# EAGLE schematic Street_Fighter_v1.2 (EAGLE 7.5.0)
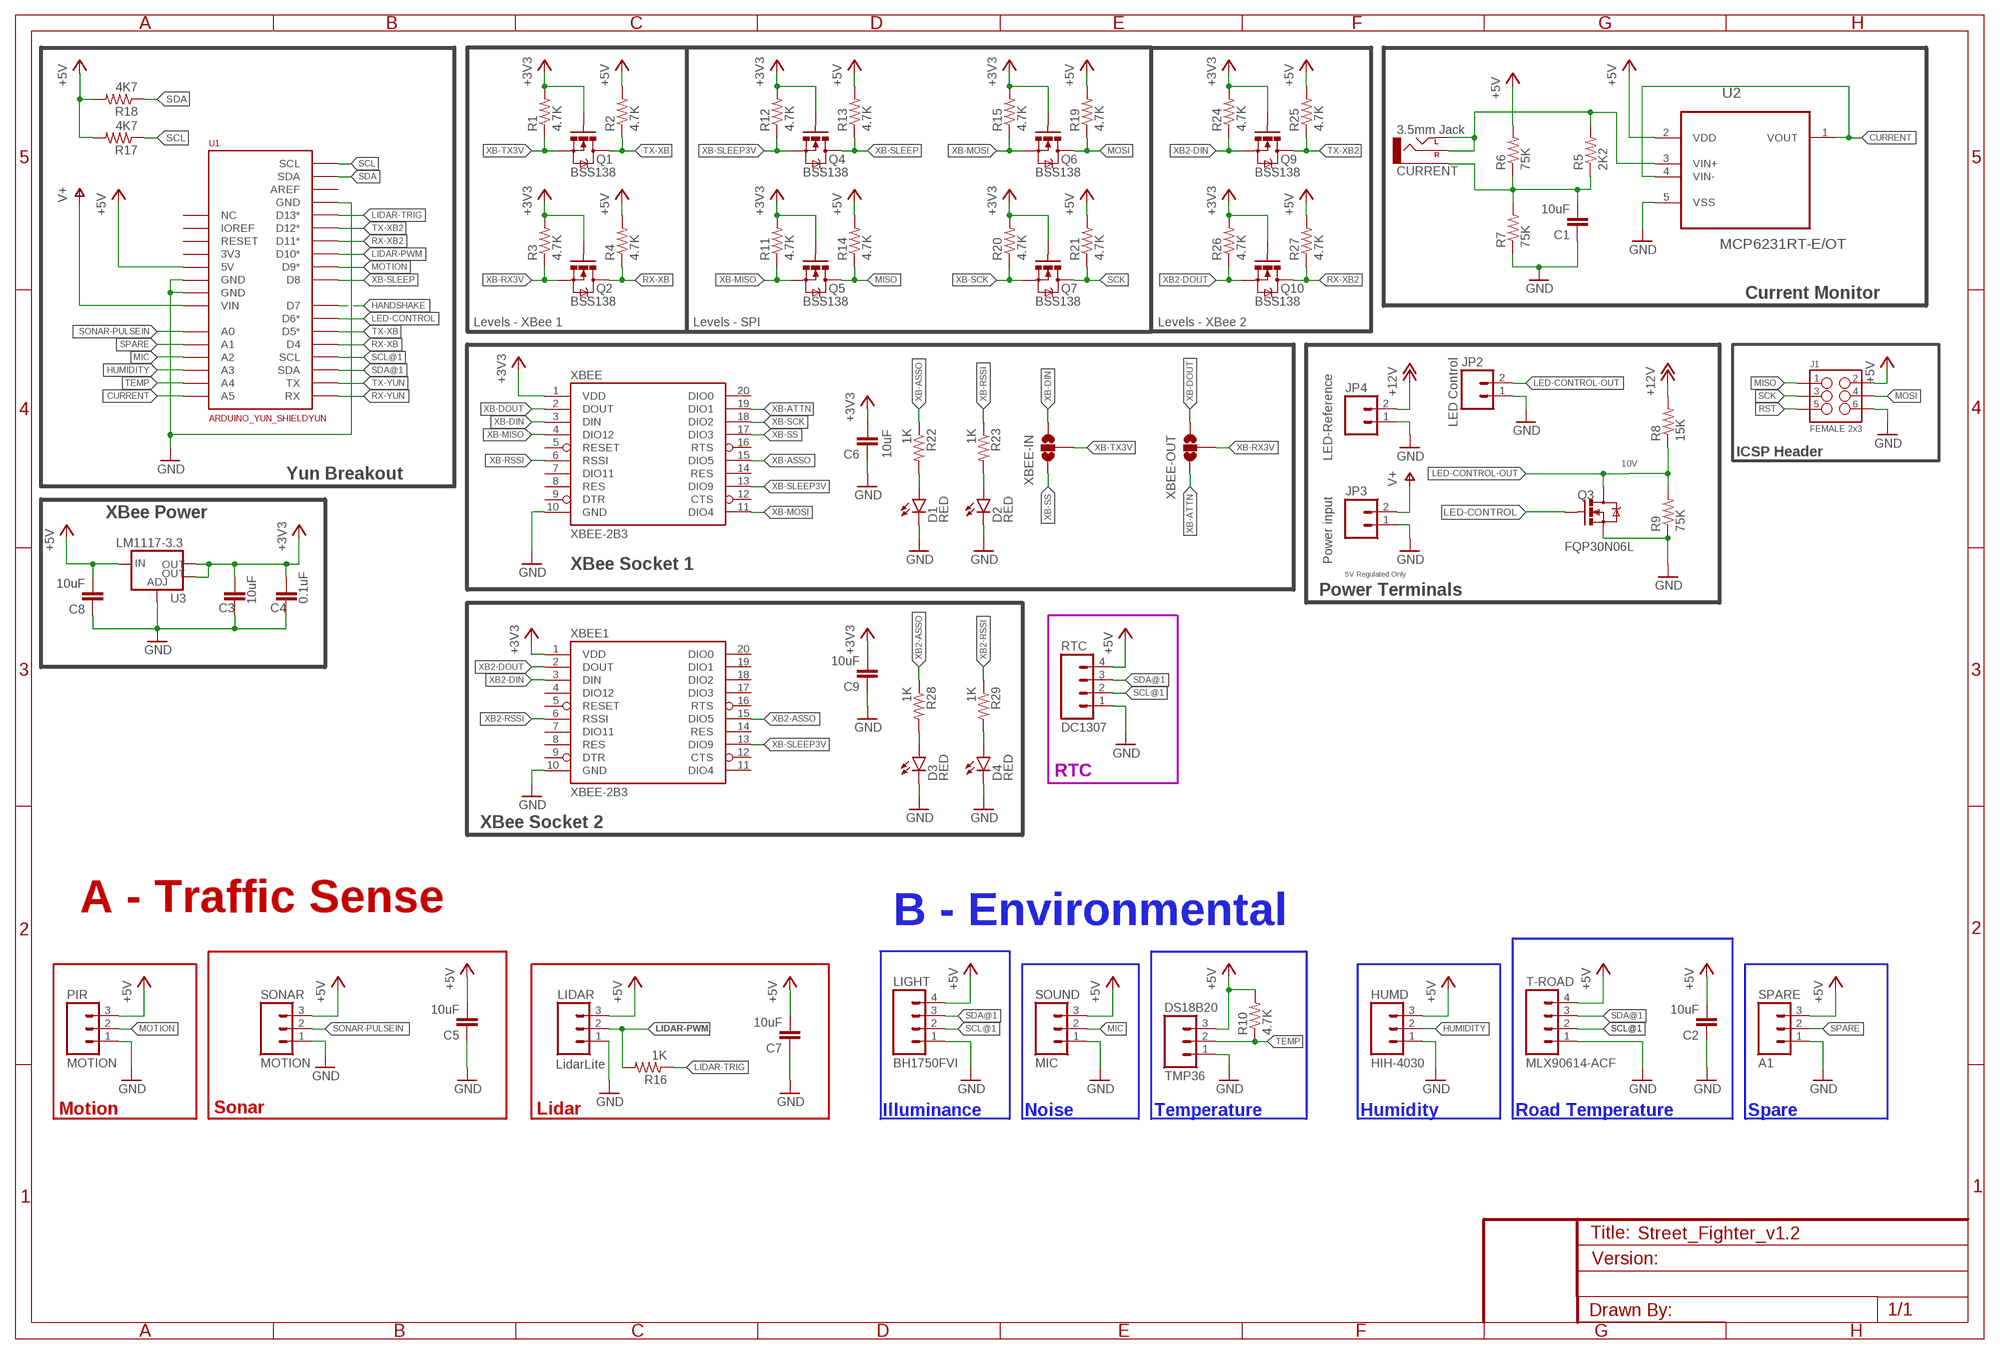
[diagram p0: schematic, sheet 1]

## Parts
C1  10uF  10UF-6.3V-20%(1206)  [1206]
C2  10uF  10UF-6.3V-20%(1206)  [1206]
C3  10uF  10UF-6.3V-20%(1206)  [1206]
C4  0.1uF  10UF-6.3V-20%(1206)  [1206]
C5  10uF  10UF-6.3V-20%(1206)  [1206]
C6  10uF  10UF-6.3V-20%(1206)  [1206]
C7  10uF  10UF-6.3V-20%(1206)  [1206]
C8  10uF  10UF-6.3V-20%(1206)  [1206]
C9  10uF  10UF-6.3V-20%(1206)  [1206]
CURRENT  3.5mm Jack  AUDIO-JACKPTH  [AUDIO-JACK]
D1  RED  LED-RED1206  [LED-1206]
D2  RED  LED-RED1206  [LED-1206]
D3  RED  LED-RED1206  [LED-1206]
D4  RED  LED-RED1206  [LED-1206]
DS18B20  TMP36  M03PTH  [1X03]
HUMD  HIH-4030  M03PTH  [1X03]
J1  FEMALE 2x3  M03X2FEMALE  [2X3]
JP2  LED Control  M02PTH3  [1X02_LONGPADS]
JP3  Power input  M02PTH3  [1X02_LONGPADS]
JP4  LED-Reference  M02PTH3  [1X02_LONGPADS]
LIDAR  LidarLite  M03PTH  [1X03]
LIGHT  BH1750FVI  M04PTH  [1X04]
PIR  MOTION  M03PTH  [1X03]
Q1  BSS138  MOSFET-NCHANNELBSS123LT1G  [SOT23]
Q2  BSS138  MOSFET-NCHANNELBSS123LT1G  [SOT23]
Q3  FQP30N06L  MOSFET-NCHANNELFQP30N06L  [TO220V]
Q4  BSS138  MOSFET-NCHANNELBSS123LT1G  [SOT23]
Q5  BSS138  MOSFET-NCHANNELBSS123LT1G  [SOT23]
Q6  BSS138  MOSFET-NCHANNELBSS123LT1G  [SOT23]
Q7  BSS138  MOSFET-NCHANNELBSS123LT1G  [SOT23]
Q9  BSS138  MOSFET-NCHANNELBSS123LT1G  [SOT23]
Q10  BSS138  MOSFET-NCHANNELBSS123LT1G  [SOT23]
R1  4.7K  RESISTOR1206  [1206]
R2  4.7K  RESISTOR1206  [1206]
R3  4.7K  RESISTOR1206  [1206]
R4  4.7K  RESISTOR1206  [1206]
R5  2K2  RESISTOR1206  [1206]
R6  75K  RESISTOR1206  [1206]
R7  75K  RESISTOR1206  [1206]
R8  15K  RESISTOR1206  [1206]
R9  75K  RESISTOR1206  [1206]
R10  4.7K  RESISTOR1206  [1206]
R11  4.7K  RESISTOR1206  [1206]
R12  4.7K  RESISTOR1206  [1206]
R13  4.7K  RESISTOR1206  [1206]
R14  4.7K  RESISTOR1206  [1206]
R15  4.7K  RESISTOR1206  [1206]
R16  1K  RESISTOR1206  [1206]
R17  4K7  RESISTOR1206  [1206]
R18  4K7  RESISTOR1206  [1206]
R19  4.7K  RESISTOR1206  [1206]
R20  4.7K  RESISTOR1206  [1206]
R21  4.7K  RESISTOR1206  [1206]
R22  1K  RESISTOR1206  [1206]
R23  1K  RESISTOR1206  [1206]
R24  4.7K  RESISTOR1206  [1206]
R25  4.7K  RESISTOR1206  [1206]
R26  4.7K  RESISTOR1206  [1206]
R27  4.7K  RESISTOR1206  [1206]
R28  1K  RESISTOR1206  [1206]
R29  1K  RESISTOR1206  [1206]
RTC  DC1307  M04PTH  [1X04]
SONAR  MOTION  M03PTH  [1X03]
SOUND  MIC  M03PTH  [1X03]
SPARE  A1  M03PTH  [1X03]
T-ROAD  MLX90614-ACF  M04PTH  [1X04]
U1  ARDUINO_YUN_SHIELDYUN  [DUEMILANOVE_VIAS]
U2  MCP6231RT-E/OT  [SOT95P270X145-5N]
U3  LM1117-3.3  V_REG_LM1117SOT223  [SOT223]
XBEE  XBEE-2B3  [XBEE-SMD]
XBEE1  XBEE-2B3  [XBEE-SMD]
XBEE-IN  SOLDERJUMPER_2WAYS  [SJ_3]
XBEE-OUT  SOLDERJUMPER_2WAYS  [SJ_3]

## Nets
+3V3: C3.2 C4.2 C6.2 C9.2 Q1.1(G) Q2.1(G) Q4.1(G) Q5.1(G) Q6.1(G) Q7.1(G) Q9.1(G) Q10.1(G) R1.2 R3.2 R11.2 R12.2 R15.2 R20.2 R24.2 R26.2 U3.2(OUT) U3.4(OUT) XBEE1.1(VDD) XBEE.1(VDD)
+5V: C2.2 C5.2 C7.2 C8.2 DS18B20.3 HUMD.3 J1.2 LIDAR.3 LIGHT.4 PIR.3 R2.2 R4.2 R6.2 R10.2 R13.2 R14.2 R17.2 R18.2 R19.2 R21.2 R25.2 R27.2 RTC.4 SONAR.3 SOUND.3 SPARE.3 T-ROAD.4 U1.5V U2.2(VDD) U3.3(IN)
+12V: JP4.2 R8.2
CURRENT: U1.A5 U2.1(VOUT) U2.4(VIN-)
GND: C1.1 C2.1 C3.1 C4.1 C5.1 C6.1 C7.1 C8.1 C9.1 D1.C D2.C D3.C D4.C DS18B20.1 HUMD.1 J1.6 JP2.1 JP3.1 JP4.1 LIDAR.1 LIGHT.1 PIR.1 Q3.3(S) R7.1 R9.1 RTC.1 SONAR.1 SOUND.1 SPARE.1 T-ROAD.1 U1.GND U1.GND@0(GND) U1.GND@1(GND) U2.5(VSS) U3.1(ADJ) XBEE1.10(GND) XBEE.10(GND)
HANDSHAKE: U1.7(D7)
HUMIDITY: HUMD.2 U1.A3
LED-CONTROL: Q3.1(G) U1.6(D6*)
LED-CONTROL-OUT: JP2.2 Q3.2(D) R8.1 R9.2
LIDAR-PWM: LIDAR.2 R16.2 U1.10(D10*)
LIDAR-TRIG: R16.1 U1.13(D13*)
MIC: SOUND.2 U1.A2
MISO: J1.1 Q5.3(D) R14.1
MOSI: J1.4 Q6.3(D) R19.1
MOTION: PIR.2 U1.9(D9*)
N$1: D1.A R22.2
N$2: CURRENT.RING(RIGHT) CURRENT.TIP(LEFT) R5.2 U2.3(VIN+)
N$3: D2.A R23.2
N$4: C1.2 CURRENT.SLEEVE R5.1 R6.1 R7.2
N$5: D3.A R28.2
N$6: D4.A R29.2
RST: J1.5
RX-XB: Q2.3(D) R4.1 U1.D4
RX-XB2: Q10.3(D) R27.1 U1.11(D11*)
RX-YUN: U1.0(RX)
SCK: J1.3 Q7.3(D) R21.1
SCL: R17.1 U1.3@1(SCL)
SCL@1: LIGHT.2 RTC.2 T-ROAD.2 U1.3(SCL)
SDA: R18.1 U1.2@1(SDA)
SDA@1: LIGHT.3 RTC.3 T-ROAD.3 U1.2(SDA)
SONAR-PULSEIN: SONAR.2 U1.A0
SPARE: SPARE.2 U1.A1
TEMP: DS18B20.2 R10.1 U1.A4
TX-XB: Q1.3(D) R2.1 U1.5(D5*)
TX-XB2: Q9.3(D) R25.1 U1.12(D12*)
TX-YUN: U1.1(TX)
V+: JP3.2 U1.VIN
XB2-ASSO: R28.1 XBEE1.15(DIO5)
XB2-DIN: Q9.2(S) R24.1 XBEE1.3(DIN)
XB2-DOUT: Q10.2(S) R26.1 XBEE1.2(DOUT)
XB2-RSSI: R29.1 XBEE1.6(RSSI)
XB-ASSO: R22.1 XBEE.15(DIO5)
XB-ATTN: XBEE-OUT.1 XBEE.19(DIO1)
XB-DIN: XBEE-IN.3 XBEE.3(DIN)
XB-DOUT: XBEE-OUT.3 XBEE.2(DOUT)
XB-MISO: Q5.2(S) R11.1 XBEE.4(DIO12)
XB-MOSI: Q6.2(S) R15.1 XBEE.11(DIO4)
XB-RSSI: R23.1 XBEE.6(RSSI)
XB-RX3V: Q2.2(S) R3.1 XBEE-OUT.2
XB-SCK: Q7.2(S) R20.1 XBEE.18(DIO2)
XB-SLEEP: Q4.3(D) R13.1 U1.8(D8)
XB-SLEEP3V: Q4.2(S) R12.1 XBEE1.13(DIO9) XBEE.13(DIO9)
XB-SS: XBEE-IN.1 XBEE.17(DIO3)
XB-TX3V: Q1.2(S) R1.1 XBEE-IN.2
Unconnected: U1.AREF U1.IOREF U1.NC U1.RESET XBEE1.4(DIO12) XBEE1.5(RESET) XBEE1.7(DIO11) XBEE1.8(RES) XBEE1.9(DTR) XBEE1.11(DIO4) XBEE1.12(CTS) XBEE1.14(RES) XBEE1.16(RTS) XBEE1.17(DIO3) XBEE1.18(DIO2) XBEE1.19(DIO1) XBEE1.20(DIO0) XBEE.5(RESET) XBEE.7(DIO11) XBEE.8(RES) XBEE.9(DTR) XBEE.12(CTS) XBEE.14(RES) XBEE.16(RTS) XBEE.20(DIO0)

## Notes on the sheet
- Current Monitor
- Levels - XBee 1 | Levels - SPI | Levels - XBee 2
- ICSP Header
- 10V
- Yun Breakout
- XBee Power
- XBee Socket 1
- 5V Regulated Only
- Power Terminals
- RTC
- XBee Socket 2
- A - Traffic Sense | B - Environmental
- Motion | Sonar | Lidar | Illuminance | Noise | Temperature | Humidity | Road Temperature | Spare

## Power pins joined to a net without a drawn wire
3V3: U1.3V3

## Library data of the parts
C1-C3 C5-C9 = SparkFun-Capacitors:10UF-6.3V-20%(1206): Ceramic CAP-10057; PROD_ID: CAP-10057
C4 = SparkFun-Capacitors:10UF-6.3V-20%(1206): Ceramic CAP-10057; PROD_ID: CAP-10057; VALUE: 10uF
CURRENT = SparkFun-Connectors:AUDIO-JACK: 3.5mm Audio Jack Simple 3.5mm common PCB mount audio jack. SKU: PRT-08032
D1-D4 = SparkFun-LED:LED-RED: Assorted Red LEDs LilyPad 1206- DIO-09912 1206- DIO-00809 0603- DIO-00819 "SMART" means more efficient and expensive; PROD_ID: DIO-09912
DS18B20 HUMD LIDAR PIR SONAR SOUND SPARE = SparkFun-Connectors:M03: Header 3 Standard 3-pin 0.1" header. Use with straight break away headers (SKU : PRT-00116), right angle break away headers (PRT-00553), swiss pins (PRT-00743), machine pins (PRT-00117), and female headers (PRT-00115). Molex polarized connector foot print use with SKU : PRT-08232 with associated crimp pins and housings.
J1 = SparkFun-Connectors:M03X2: 2x3 .1" header. Shrouded, with keying- CONN-10681 SMT- CONN-11415 Pogo pins- HW-11044; PROD_ID: CONN-11566
JP2-JP4 = SparkFun-Connectors:M02: Header 2 Standard 2-pin 0.1" header. Use with straight break away headers (SKU : PRT-00116), right angle break away headers (PRT-00553), swiss pins (PRT-00743), machine pins (PRT-00117), and female headers (PRT-00115). Molex polarized connector foot print use with SKU : PRT-08233 with associated crimp pins and housings.
LIGHT RTC T-ROAD = SparkFun-Connectors:M04: Header 4 Standard 4-pin 0.1" header. Use with straight break away headers (SKU : PRT-00116), right angle break away headers (PRT-00553), swiss pins (PRT-00743), machine pins (PRT-00117), and female headers (PRT-00115). Molex polarized connector foot print use with SKU : PRT-08231 with associated crimp pins and housings. 1MM SMD Version SKU: PRT-10208
Q1 Q2 Q4-Q7 Q9 Q10 = SparkFun-DiscreteSemi:MOSFET-NCHANNEL: Common NMOSFET Parts MFG P/N Store ID Prod ID FDD8780 TRANS-09984 SI7820DN TRANS-11055 FDS6630A IC-08089 2N7002PW TRANS-11151 FQP30N06L COM-10213 TRANS-10060 BSS123LT1G TRANS-08345 BSS138 TRANS-00830 BS170 2N7000; PROD_ID: TRANS-08345
Q3 = SparkFun-DiscreteSemi:MOSFET-NCHANNEL: Common NMOSFET Parts MFG P/N Store ID Prod ID FDD8780 TRANS-09984 SI7820DN TRANS-11055 FDS6630A IC-08089 2N7002PW TRANS-11151 FQP30N06L COM-10213 TRANS-10060 BSS123LT1G TRANS-08345 BSS138 TRANS-00830 BS170 2N7000; PROD_ID: TRANS-10060
R1-R29 = SparkFun-Passives:RESISTOR: Resistor Basic schematic elements and footprints for 0603, 1206, and PTH resistors.
U1 = SparkFun-Boards:ARDUINO_YUN_SHIELD
U2 = Microchip_By_element14_Batch_1:MCP6231RT-E/OT: 20 µA, 300 kHz Rail-to-Rail Op Amp; DESCRIPTION: OP AMP; MPN: MCP6231RT-E/OT; OC_FARNELL: 1840878; OC_NEWARK: 84R5186; PACKAGE: SOT-5; SUPPLIER: Microchip
U3 = SparkFun-PowerIC:V_REG_LM1117: Voltage Regulator LM1117 Standard adjustable voltage regulator but in SMD form. Spark Fun Electronics SKU : COM-00595; PROD_ID: VREG-08170
XBEE XBEE1 = SparkFun-RF:XBEE-2: Xbee module footprints SMT header is CONN-09042.; PROD_ID: CONN-09042
XBEE-IN XBEE-OUT = SparkFun-Retired:SOLDERJUMPER_2WAY: Solder Jumper 2 way solder jumper